# Altium schematic sheet CircleValve.SchDoc
size A4
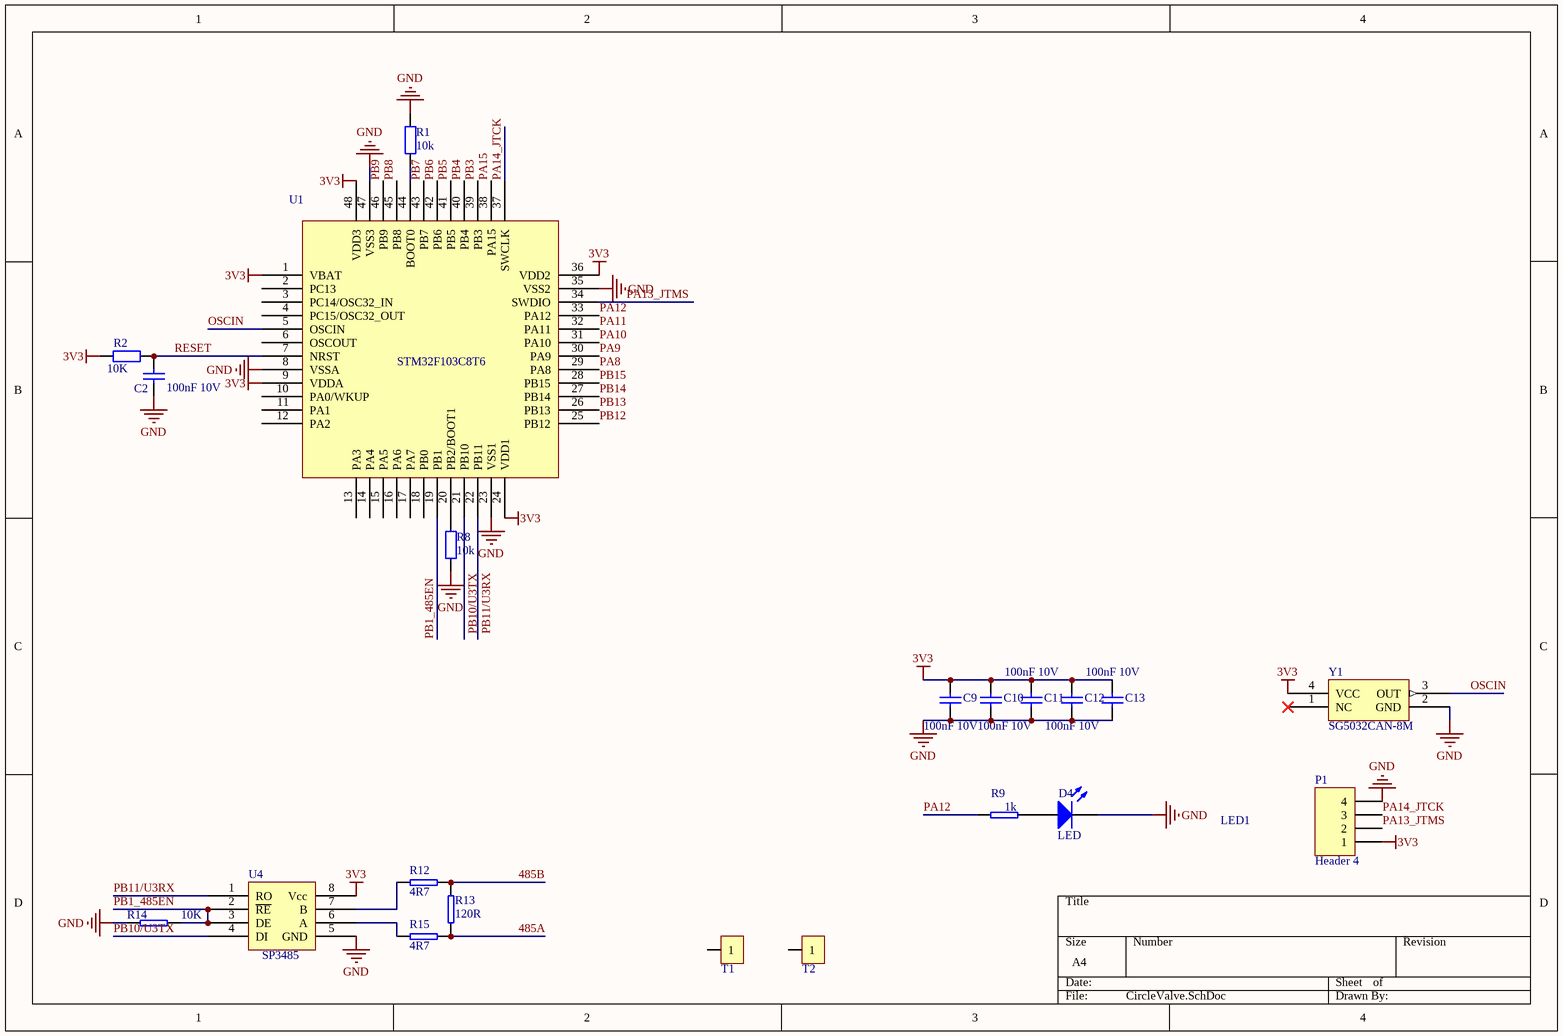
[diagram p0: CircleValve.SchDoc]

## Parts
C2  100nF 10V  [C0603]
C9  100nF 10V  [C0603]
C10  100nF 10V  [C0603]
C11  100nF 10V  [C0603]
C12  100nF 10V  [C0603]
C13  100nF 10V  [C0603]
D4  LED  [LED_M]
P1  Header 4  [Header4-2.54mm]
R1  10k  [R0603]
R2  10K  [R0603]
R8  10k  [R0603]
R9  1k  [R0603]
R12  4R7  [R0603]
R13  120R  [R0603]
R14  10K  [R0603]
R15  4R7  [R0603]
T1  TP  [定位孔3mm]  (value not drawn)
T2  TP  [定位孔3mm]  (value not drawn)
U1  STM32F103C8T6  [LQFP-48_7x7x05P]
U4  SP3485  [SO8]
Y1  SG5032CAN-8M  [XTAL-4P-5*3MM]

## Nets
3V3: C9.2 C10.2 C11.2 C12.2 C13.2 P1.1 R2.1 U1.1(VBAT) U1.9(VDDA) U1.24(VDD1) U1.36(VDD2) U1.48(VDD3) U4.8(Vcc) Y1.4(VCC)
GND: C2.2 C9.1 C10.1 C11.1 C12.1 C13.1 D4.2(K) P1.4 R1.2 R8.1 R14.1 U1.8(VSSA) U1.23(VSS1) U1.35(VSS2) U1.47(VSS3) U4.5(GND) Y1.2(GND)
485A: R13.2 R15.1
485B: R12.1 R13.1
OSCIN: U1.5(OSCIN) Y1.3(OUT)
PA8: U1.29(PA8)
PA9: U1.30(PA9)
PA10: U1.31(PA10)
PA11: U1.32(PA11)
PA12: R9.1 U1.33(PA12)
PA13_JTMS: P1.2 U1.34(SWDIO)
PA14_JTCK: P1.3 U1.37(SWCLK)
PA15: U1.38(PA15)
PB1_485EN: R14.2 U1.19(PB1) U4.2(~{RE}) U4.3(DE)
PB3: U1.39(PB3)
PB4: U1.40(PB4)
PB5: U1.41(PB5)
PB6: U1.42(PB6)
PB7: U1.43(PB7)
PB8: U1.45(PB8)
PB9: U1.46(PB9)
PB10/U3TX: U1.21(PB10) U4.4(DI)
PB11/U3RX: U1.22(PB11) U4.1(RO)
PB12: U1.25(PB12)
PB13: U1.26(PB13)
PB14: U1.27(PB14)
PB15: U1.28(PB15)
RESET: C2.1 R2.2 U1.7(NRST)
NetD4_1: D4.1(A) R9.2
NetR1_1: R1.1 U1.44(BOOT0)
NetR8_2: R8.2 U1.20(PB2/BOOT1)
NetR12_2: R12.2 U4.7(B)
NetR15_2: R15.2 U4.6(A)

Not connected (* = marked no-connect by the designer): T1 1; T2 1; U1 2(PC13) 3(PC14/OSC32_IN) 4(PC15/OSC32_OUT) 6(OSCOUT) 10(PA0/WKUP) 11(PA1) 12(PA2) 13(PA3) 14(PA4) 15(PA5) 16(PA6) 17(PA7) 18(PB0); Y1 1(NC)*

## Notes on the sheet
- LED1

## Library data of the parts
C2 C9-C13 = CAP
D4 = LED: 绿色
P1 = Header 4: Header, 4-Pin; LatestRevisionDate: 17-Jul-2002; LatestRevisionNote: Re-released for DXP Platform.; Publisher: Altium Limited
R1 R2 R8 = RES
R9 R12-R15 = R: 标贴电阻
U4 = RS485
Y1 = XTAL_POWER: 贴片有源晶振-8M